# EAGLE design BatteryBalancer (EAGLE 9.2.2)

## Sheet 1 of 4: Connectors
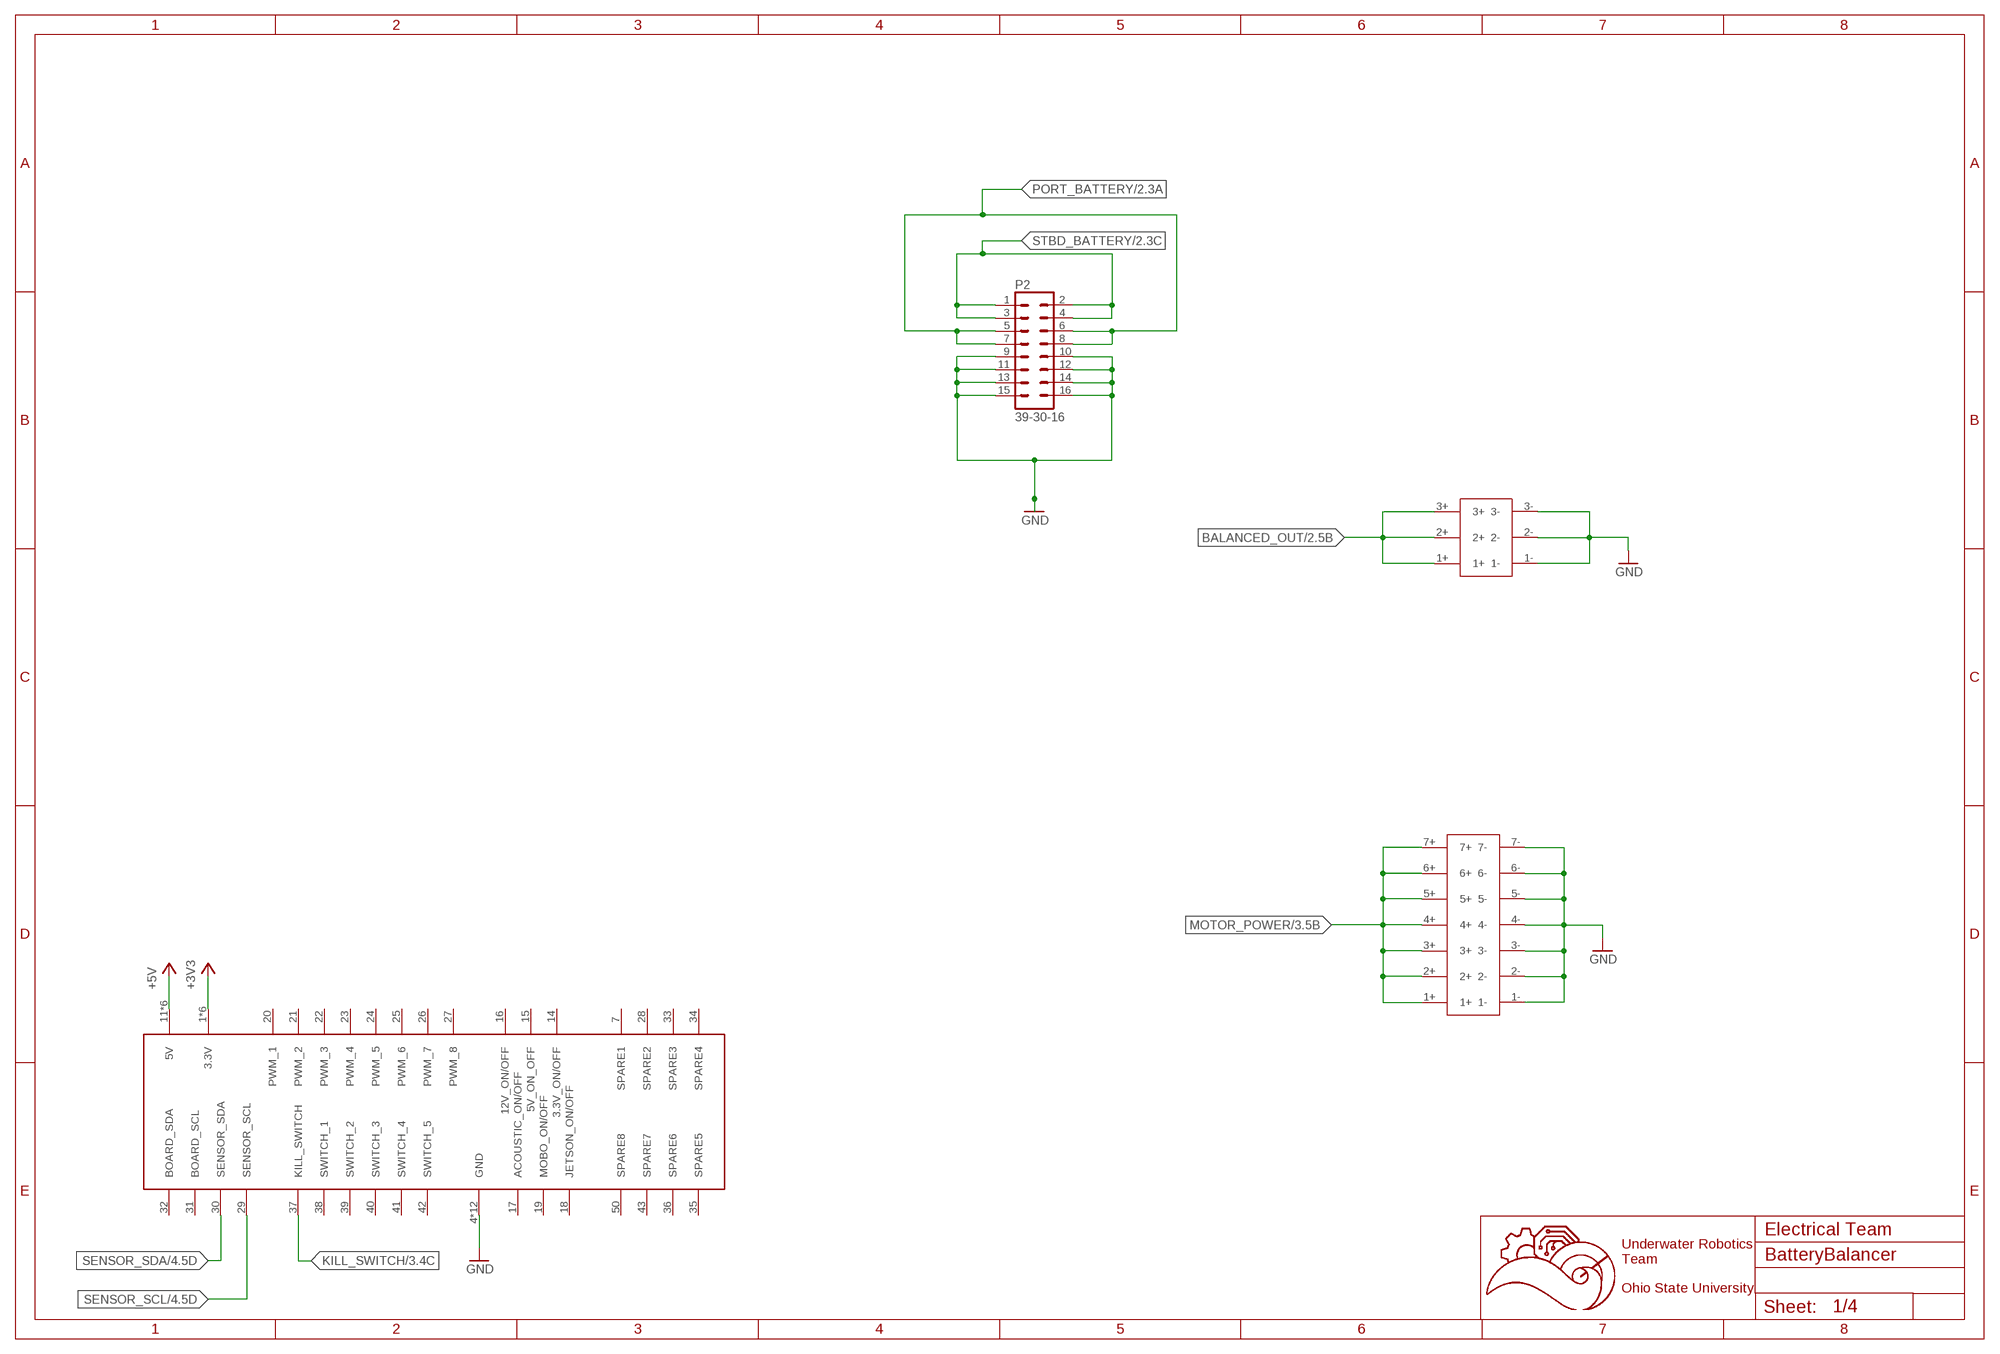
[diagram p0: schematic, sheet 1]

### Parts
P2  39-30-16  [39-30-?16?]
U$1  5530843-EDGE  [5530843-6-BOARDFINGERS]
U$4  14PIN-VERT  [14PIN_VERT]
U$13  6PIN-VERT  [6PIN_VERT]

### Nets
+3V3: U$1.1(3.3V) U$1.2(3.3V) U$1.3(3.3V) U$1.54(3.3V) U$1.55(3.3V) U$1.56(3.3V) ; also sheet 2,3,4
+5V: U$1.11(5V) U$1.12(5V) U$1.13(5V) U$1.44(5V) U$1.45(5V) U$1.46(5V)
BALANCED_OUT: U$13.1+ U$13.2+ U$13.3+ ; also sheet 2,3,4
GND: P2.9 P2.10 P2.11 P2.12 P2.13 P2.14 P2.15 P2.16 U$1.4(GND) U$1.5(GND) U$1.6(GND) U$1.8(GND) U$1.9(GND) U$1.10(GND) U$1.47(GND) U$1.48(GND) U$1.49(GND) U$1.51(GND) U$1.52(GND) U$1.53(GND) U$4.1- U$4.2- U$4.3- U$4.4- U$4.5- U$4.6- U$4.7- U$13.1- U$13.2- U$13.3- ; also sheet 2,4
KILL_SWITCH: U$1.37(KILL_SWITCH) ; also sheet 3
MOTOR_POWER: U$4.1+ U$4.2+ U$4.3+ U$4.4+ U$4.5+ U$4.6+ U$4.7+ ; also sheet 3
PORT_BATTERY: P2.5 P2.6 P2.7 P2.8 ; also sheet 2,4
SENSOR_SCL: U$1.29(SENSOR_SCL) ; also sheet 4
SENSOR_SDA: U$1.30(SENSOR_SDA) ; also sheet 4
STBD_BATTERY: P2.1 P2.2 P2.3 P2.4 ; also sheet 2,4
Unconnected: U$1.7(SPARE1) U$1.14(3.3V_ON/OFF) U$1.15(5V_ON_OFF) U$1.16(12V_ON/OFF) U$1.17(ACOUSTIC_ON/OFF) U$1.18(JETSON_ON/OFF) U$1.19(MOBO_ON/OFF) U$1.20(PWM_1) U$1.21(PWM_2) U$1.22(PWM_3) U$1.23(PWM_4) U$1.24(PWM_5) U$1.25(PWM_6) U$1.26(PWM_7) U$1.27(PWM_8) U$1.28(SPARE2) U$1.31(BOARD_SCL) U$1.32(BOARD_SDA) U$1.33(SPARE3) U$1.34(SPARE4) U$1.35(SPARE5) U$1.36(SPARE6) U$1.38(SWITCH_1) U$1.39(SWITCH_2) U$1.40(SWITCH_3) U$1.41(SWITCH_4) U$1.42(SWITCH_5) U$1.43(SPARE7) U$1.50(SPARE8)

### Notes on the sheet
- Electrical Team
- Underwater Robotics
  Team
  
  Ohio State University

## Sheet 2 of 4: Balancing
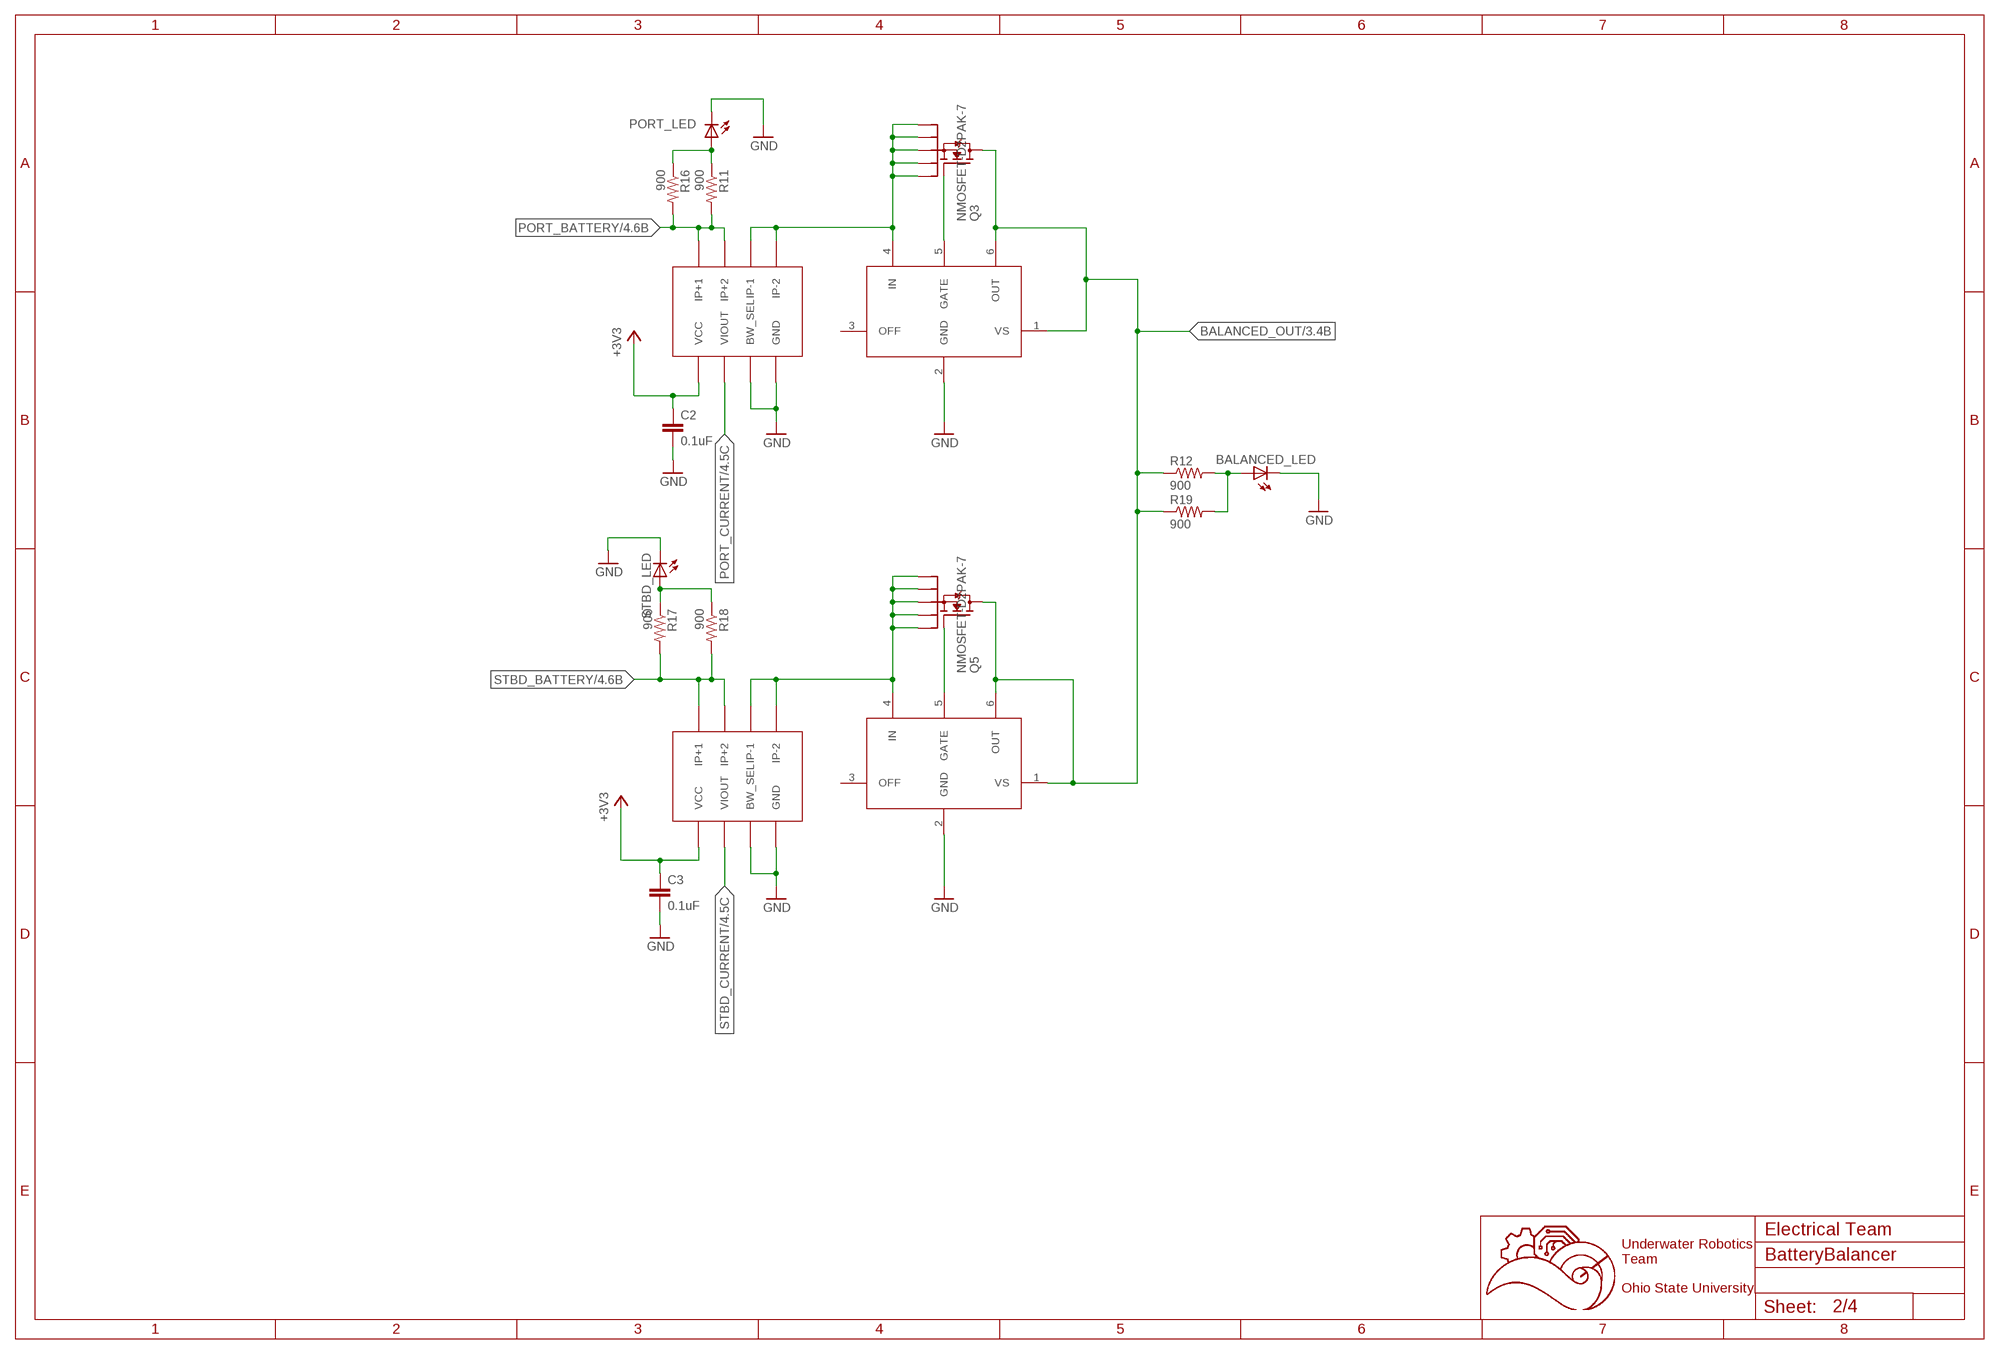
[diagram p1: schematic, sheet 2]

### Parts
BALANCED_LED  LEDCHIP-LED0603  [CHIP-LED0603]
C2  0.1uF  C-EUC0603  [C0603]
C3  0.1uF  C-EUC0603  [C0603]
PORT_LED  LEDCHIP-LED0603  [CHIP-LED0603]
Q3  NMOSFET-D2PAK-7  [D2PAK-7]
Q5  NMOSFET-D2PAK-7  [D2PAK-7]
R11  900  R-US_R0603  [R0603]
R12  900  R-US_R0603  [R0603]
R16  900  R-US_R0603  [R0603]
R17  900  R-US_R0603  [R0603]
R18  900  R-US_R0603  [R0603]
R19  900  R-US_R0603  [R0603]
STBD_LED  LEDCHIP-LED0603  [CHIP-LED0603]
U$2  LM5050  [LM5050]
U$3  LM5050  [LM5050]
U$6  ACS722  [SOIC-8]
U$7  ACS722  [SOIC-8]

### Nets
+3V3: C2.1 C3.1 U$6.VCC U$7.VCC ; also sheet 1,3,4
BALANCED_OUT: Q3.D Q5.D R12.1 R19.1 U$2.1(VS) U$2.6(OUT) U$3.1(VS) U$3.6(OUT) ; also sheet 1,3,4
GND: BALANCED_LED.C C2.2 C3.2 PORT_LED.C STBD_LED.C U$2.2(GND) U$3.2(GND) U$6.BW_SEL U$6.GND U$7.BW_SEL U$7.GND ; also sheet 1,4
N$1: Q3.S1 Q3.S2 Q3.S3 Q3.S4 Q3.S5 U$2.4(IN) U$6.IP-1 U$6.IP-2
N$2: Q3.G U$2.5(GATE)
N$5: Q5.G U$3.5(GATE)
N$11: PORT_LED.A R11.1 R16.1
N$12: R17.1 R18.1 STBD_LED.A
N$13: BALANCED_LED.A R12.2 R19.2
PORT_BATTERY: R11.2 R16.2 U$6.IP+1 U$6.IP+2 ; also sheet 1,4
PORT_CURRENT: U$6.VIOUT ; also sheet 4
SOURCE: Q5.S1 Q5.S2 Q5.S3 Q5.S4 Q5.S5 U$3.4(IN) U$7.IP-1 U$7.IP-2
STBD_BATTERY: R17.2 R18.2 U$7.IP+1 U$7.IP+2 ; also sheet 1,4
STBD_CURRENT: U$7.VIOUT ; also sheet 4
Unconnected: U$2.3(OFF) U$3.3(OFF)

### Notes on the sheet
- Electrical Team
- Underwater Robotics
  Team
  
  Ohio State University

## Sheet 3 of 4: Relays
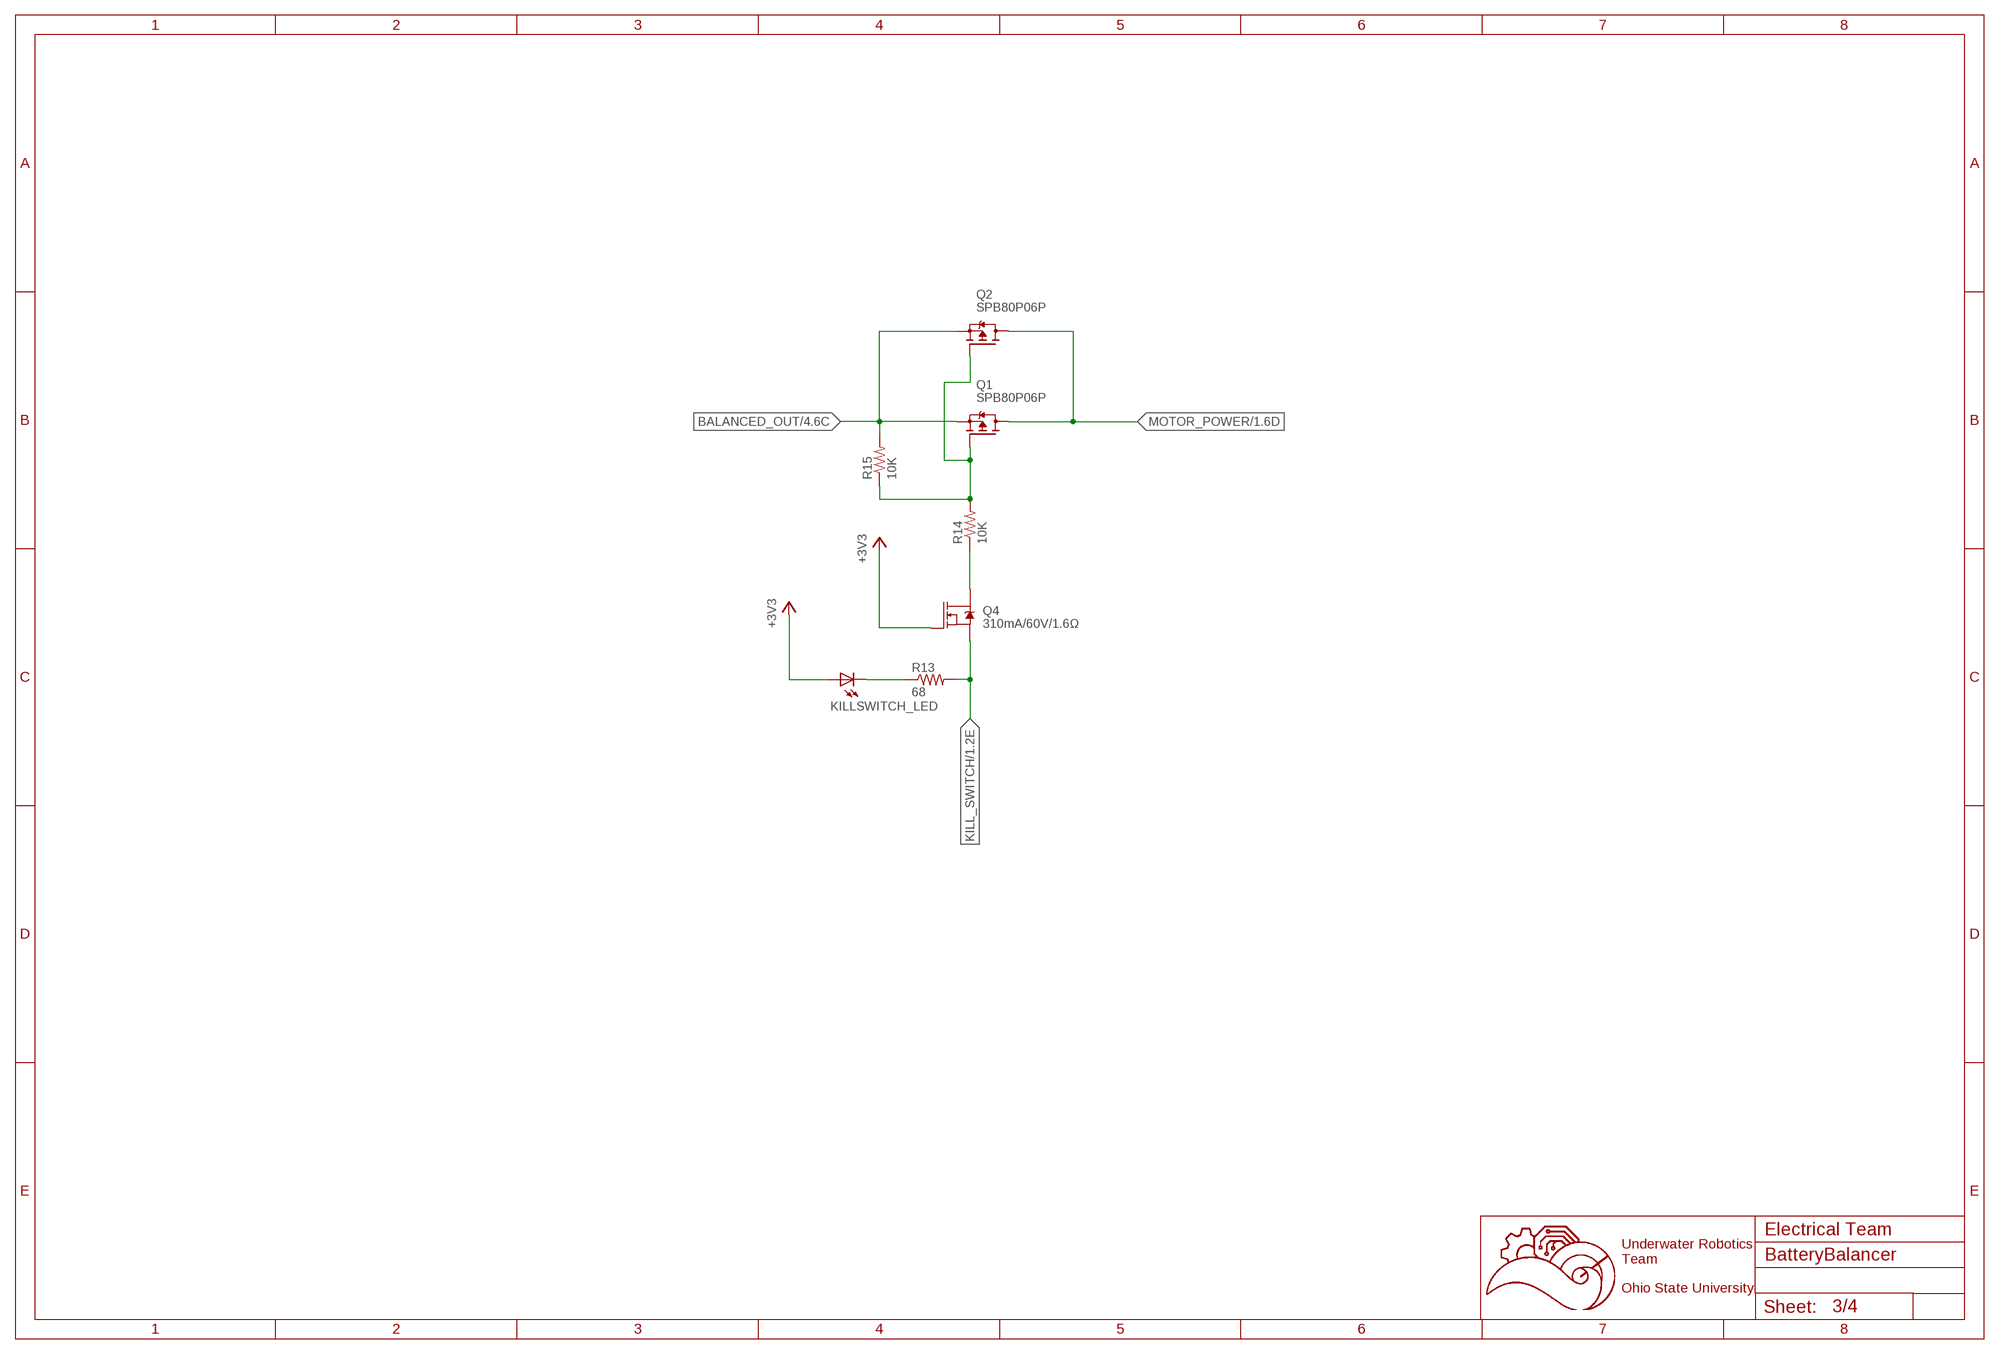
[diagram p2: schematic, sheet 3]

### Parts
KILLSWITCH_LED  LEDCHIP-LED0603  [CHIP-LED0603]
Q1  SPB80P06P  [TO263]
Q2  SPB80P06P  [TO263]
Q4  310mA/60V/1.6Ω  MOSFET-NCH-2N7002PW  [SOT323]
R13  68  R-US_R0603  [R0603]
R14  10K  R-US_R0603  [R0603]
R15  10K  R-US_R0603  [R0603]

### Nets
+3V3: KILLSWITCH_LED.A Q4.1(G) ; also sheet 1,2,4
BALANCED_OUT: Q1.2(S) Q2.2(S) R15.2 ; also sheet 1,2,4
KILL_SWITCH: Q4.2(S) R13.2 ; also sheet 1
MOTOR_POWER: Q1.3(D) Q2.3(D) ; also sheet 1
N$4: Q4.3(D) R14.1
N$8: Q1.1(G) Q2.1(G) R14.2 R15.1
N$16: KILLSWITCH_LED.C R13.1

### Notes on the sheet
- Electrical Team
- Underwater Robotics
  Team
  
  Ohio State University

## Sheet 4 of 4: ADC
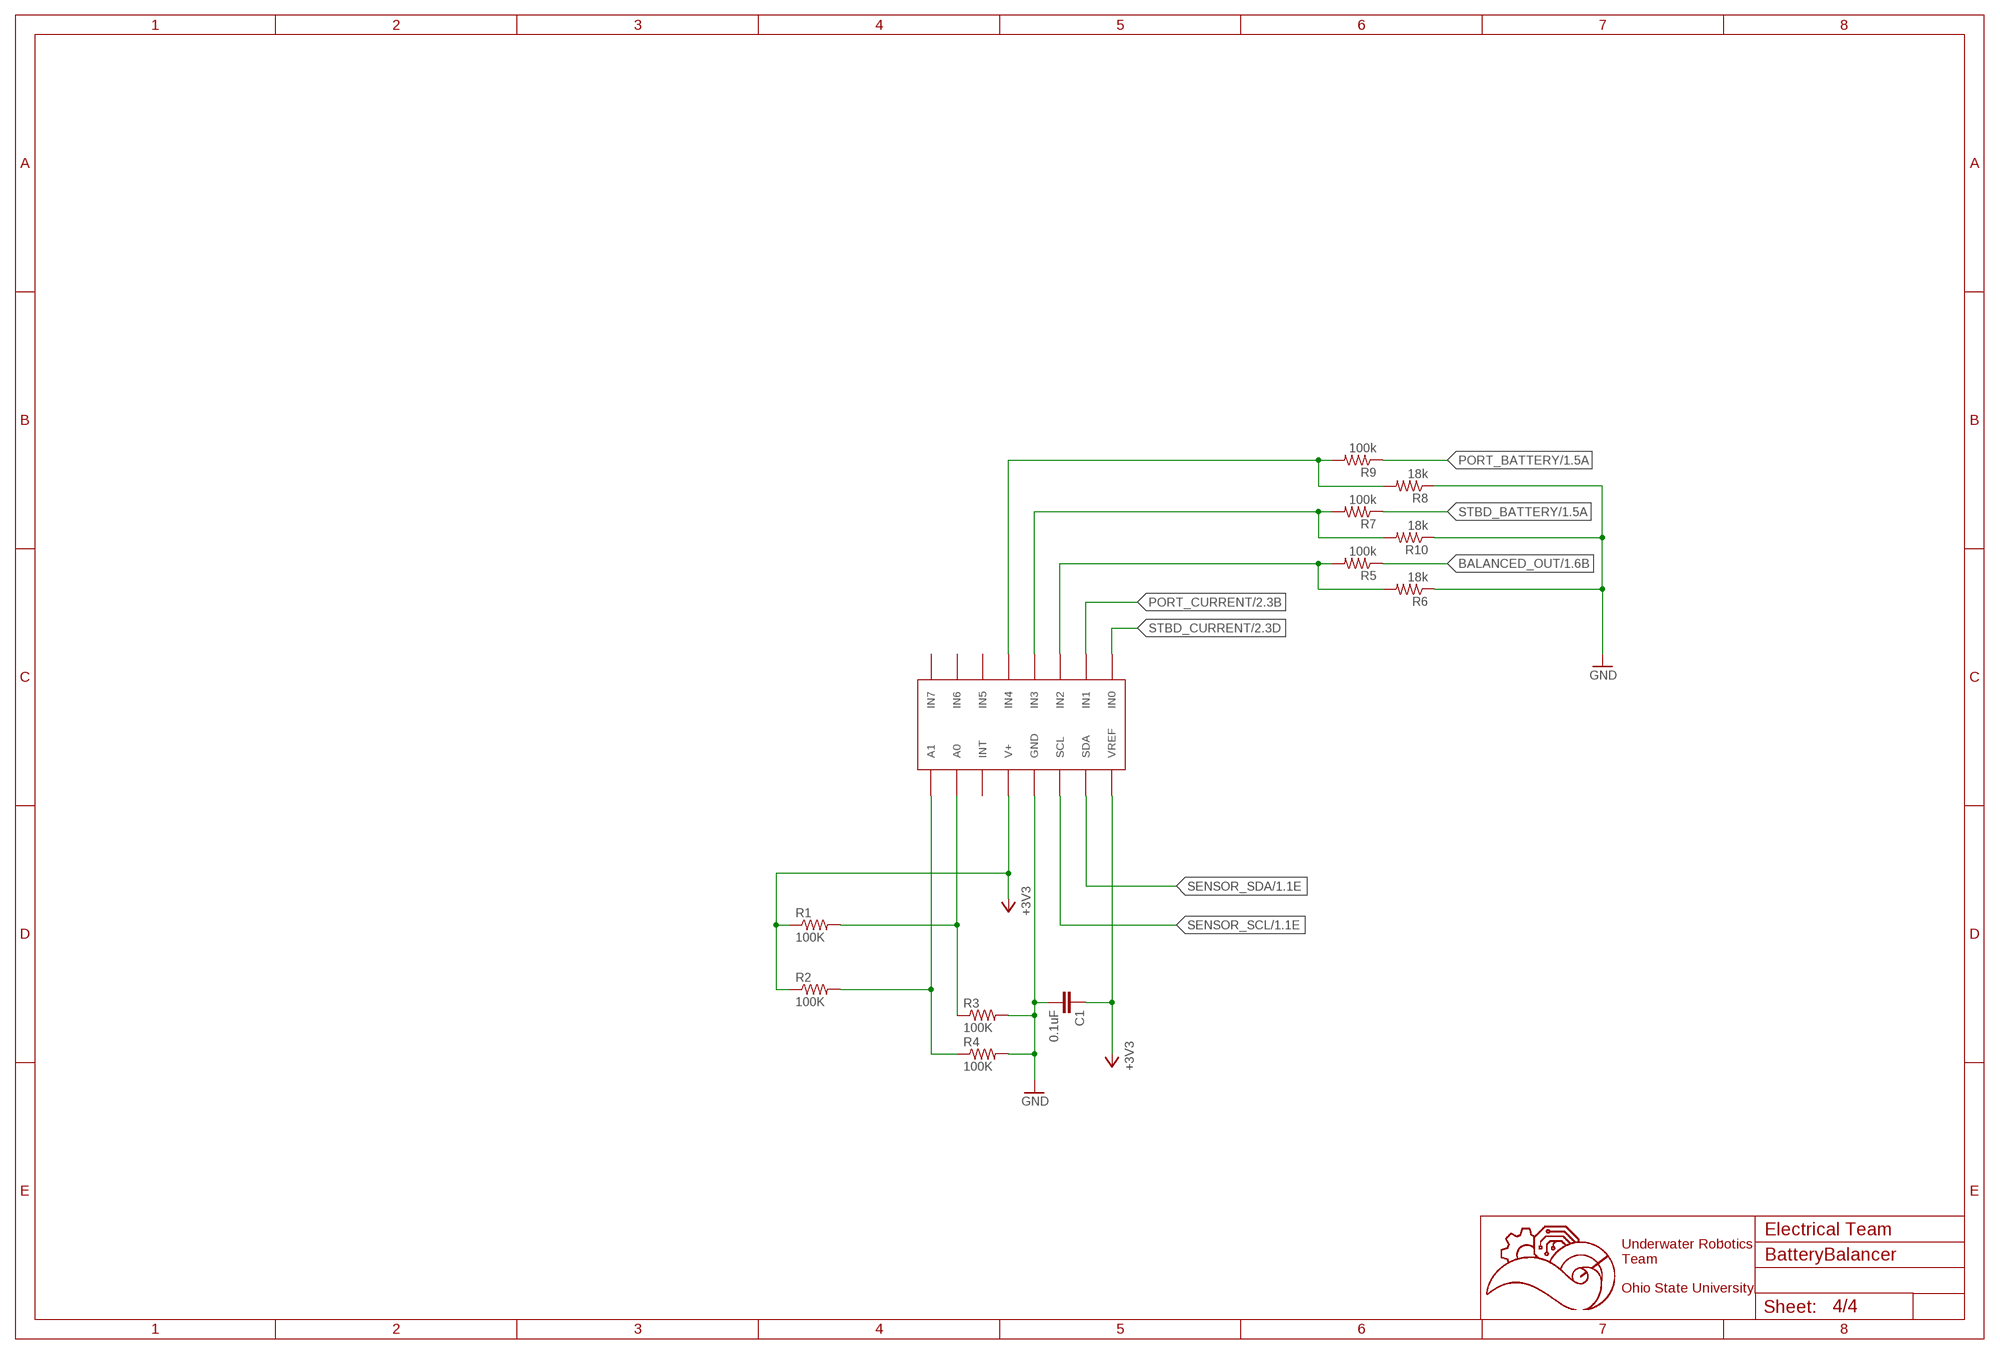
[diagram p3: schematic, sheet 4]

### Parts
C1  0.1uF  C-EUC0603  [C0603]
R1  100K  R-US_R0603  [R0603]
R2  100K  R-US_R0603  [R0603]
R3  100K  R-US_R0603  [R0603]
R4  100K  R-US_R0603  [R0603]
R5  100k  R-US_R0603  [R0603]
R6  18k  R-US_R0603  [R0603]
R7  100k  R-US_R0603  [R0603]
R8  18k  R-US_R0603  [R0603]
R9  100k  R-US_R0603  [R0603]
R10  18k  R-US_R0603  [R0603]
U$12  ADC128D818  [TSSOP-16]

### Nets
+3V3: C1.1 R1.1 R2.1 U$12.V+ U$12.VREF ; also sheet 1,2,3
BALANCED_OUT: R5.1 ; also sheet 1,2,3
GND: C1.2 R3.2 R4.2 R6.1 R8.1 R10.1 U$12.GND ; also sheet 1,2
N$6: R2.2 R4.1 U$12.A1
N$7: R1.2 R3.1 U$12.A0
N$9: R7.2 R10.2 U$12.IN3
N$10: R8.2 R9.2 U$12.IN4
N$15: R5.2 R6.2 U$12.IN2
PORT_BATTERY: R9.1 ; also sheet 1,2
PORT_CURRENT: U$12.IN1 ; also sheet 2
SENSOR_SCL: U$12.SCL ; also sheet 1
SENSOR_SDA: U$12.SDA ; also sheet 1
STBD_BATTERY: R7.1 ; also sheet 1,2
STBD_CURRENT: U$12.IN0 ; also sheet 2
Unconnected: U$12.IN5 U$12.IN6 U$12.IN7 U$12.INT

### Notes on the sheet
- Electrical Team
- Underwater Robotics
  Team
  
  Ohio State University

## Library data of the parts
BALANCED_LED KILLSWITCH_LED PORT_LED STBD_LED = led:LED: LED OSRAM: - CHIPLED LG R971, LG N971, LY N971, LG Q971, LY Q971, LO R971, LY R971 LH N974, LH R974 LS Q976, LO Q976, LY Q976 LO Q996 - Hyper CHIPLED LW Q18S LB Q993, LB Q99A, LB R99A - SideLED LS A670, LO A670, LY A670, LG A670, LP A670 LB A673, LV A673, LT A673, LW A673 LH A674 LY A675 LS A676, LA A676, LO A676, LY A676, LW A676 LS A679, LY A679, LG A679 - Hyper Micro SIDELED® LS Y876, LA Y876, LO Y876, LY Y876 LT Y87S - SmartLED LW L88C, LW L88S LB L89C, LB L89S, LG L890 LS L89K, LO L89K, LY L89K LS L896, LA L896, LO L896, LY L896 - TOPLED LS T670, LO T670, LY T670, LG T670, LP T670 LSG T670, LSP T670, LSY T670, LOP T670, LYG T670 LG T671, LOG T671, LSG T671 LB T673, LV T673, LT T673, LW T673 LH T674 LS T676, LA T676, LO T676, LY T676, LB T676, LH T676, LSB T676, LW T676 LB T67C, LV T67C, LT T67C, LS T67K, LO T67K, LY T67K, LW E67C LS E67B, LA E67B, LO E67B, LY E67B, LB E67C, LV E67C, LT E67C LW T67C LS T679, LY T679, LG T679 LS T770, LO T770, LY T770, LG T770, LP T770 LB T773, LV T773, LT T773, LW T773 LH T774 LS E675, LA E675, LY E675, LS T675 LS T776, LA T776, LO T776, LY T776, LB T776 LHGB T686 LT T68C, LB T68C - Hyper Mini TOPLED® LB M676 - Mini TOPLED Santana® LG M470 LS M47K, LO M47K, LY M47K Source: http://www.osram.convergy.de LUXEON: - LUMILED® LXK2-PW12-R00, LXK2-PW12-S00, LXK2-PW14-U00, LXK2-PW14-V00 LXK2-PM12-R00, LXK2-PM12-S00, LXK2-PM14-U00 LXK2-PE12-Q00, LXK2-PE12-R00, LXK2-PE12-S00, LXK2-PE14-T00, LXK2-PE14-U00 LXK2-PB12-K00, LXK2-PB12-L00, LXK2-PB12-M00, LXK2-PB14-N00, LXK2-PB14-P00, LXK2-PB14-Q00 LXK2-PR12-L00, LXK2-PR12-M00, LXK2-PR14-Q00, LXK2-PR14-R00 LXK2-PD12-Q00, LXK2-PD12-R00, LXK2-PD12-S00 LXK2-PH12-R00, LXK2-PH12-S00 LXK2-PL12-P00, LXK2-PL12-Q00, LXK2-PL12-R00 Source: www.luxeon.com KINGBRIGHT: KA-3528ASYC Source: www.kingbright.com
C1-C3 = rcl:C-EU: CAPACITOR, European symbol; SPICEPREFIX: C
P2 = con-molex-mini-fit:39-30-?16?: HEADER
Q1 Q2 = transistor-fet:SPB80P06P: SIPMOS (R) Power-Transistor P-Channel, Enhancement mode Source: http://www.infineon.com/upload/Document/cmc_upload/documents/011/3685/SPP80P06P.pdf
Q3 Q5 = D2PAK-7:NMOSFET-D2PAK-7
Q4 = SparkFun-DiscreteSemi:MOSFET-NCH: N-channel MOSFETs Voltage controlled devices that allow control of high current outputs. SparkFun Products: SparkFun OpenScale <https://www.sparkfun.com/products/13261> SparkFun Digital Sandbox <https://www.sparkfun.com/products/12651> SparkFun Monster Moto Shield <https://www.sparkfun.com/products/10182> SparkFun MOSFET Power Controller <https://www.sparkfun.com/products/11214>; PROD_ID: TRANS-11151
R1-R19 = rcl:R-US_: RESISTOR, American symbol; SPICEPREFIX: R
U$1 = 5530843-6:5530843-EDGE
U$2 U$3 = LM5050:LM5050
U$4 = Vertical_Connectors:14PIN-VERT
U$6 U$7 = ACS722:ACS722
U$12 = ADC128D818:ADC128D818
U$13 = Vertical_Connectors:6PIN-VERT

## Board
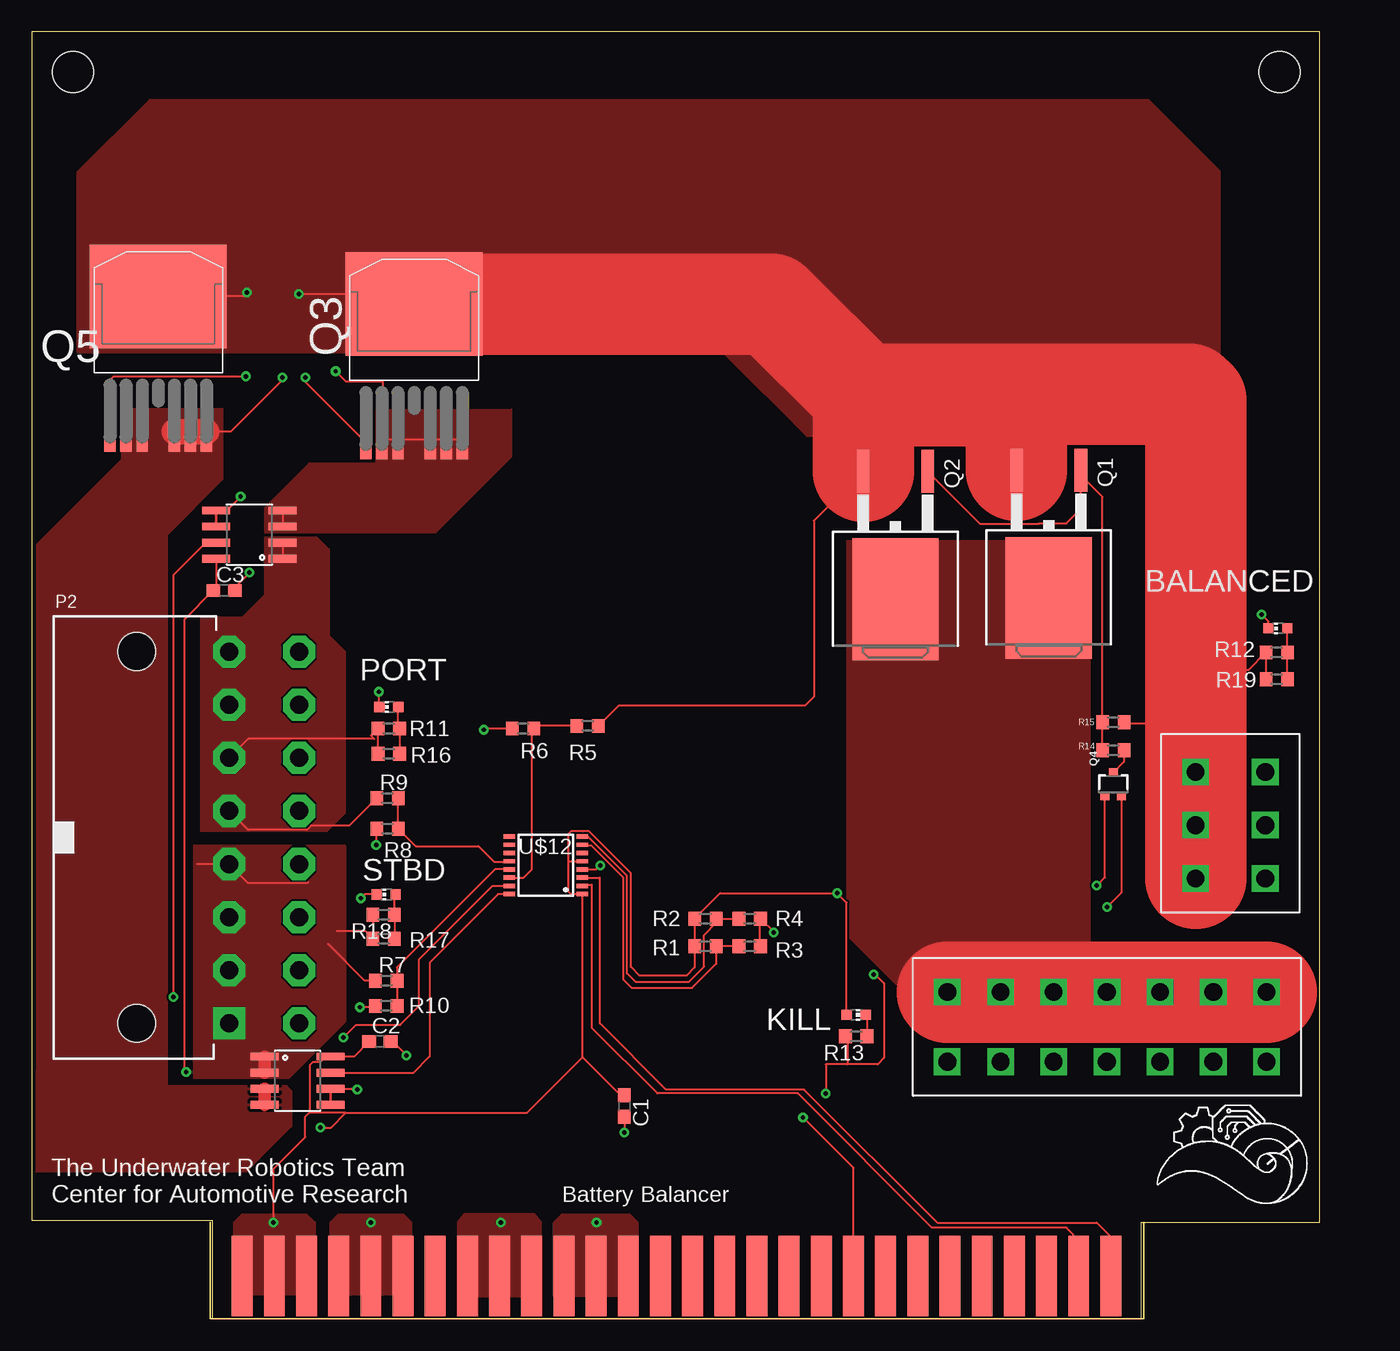
[diagram p4: board, top side]
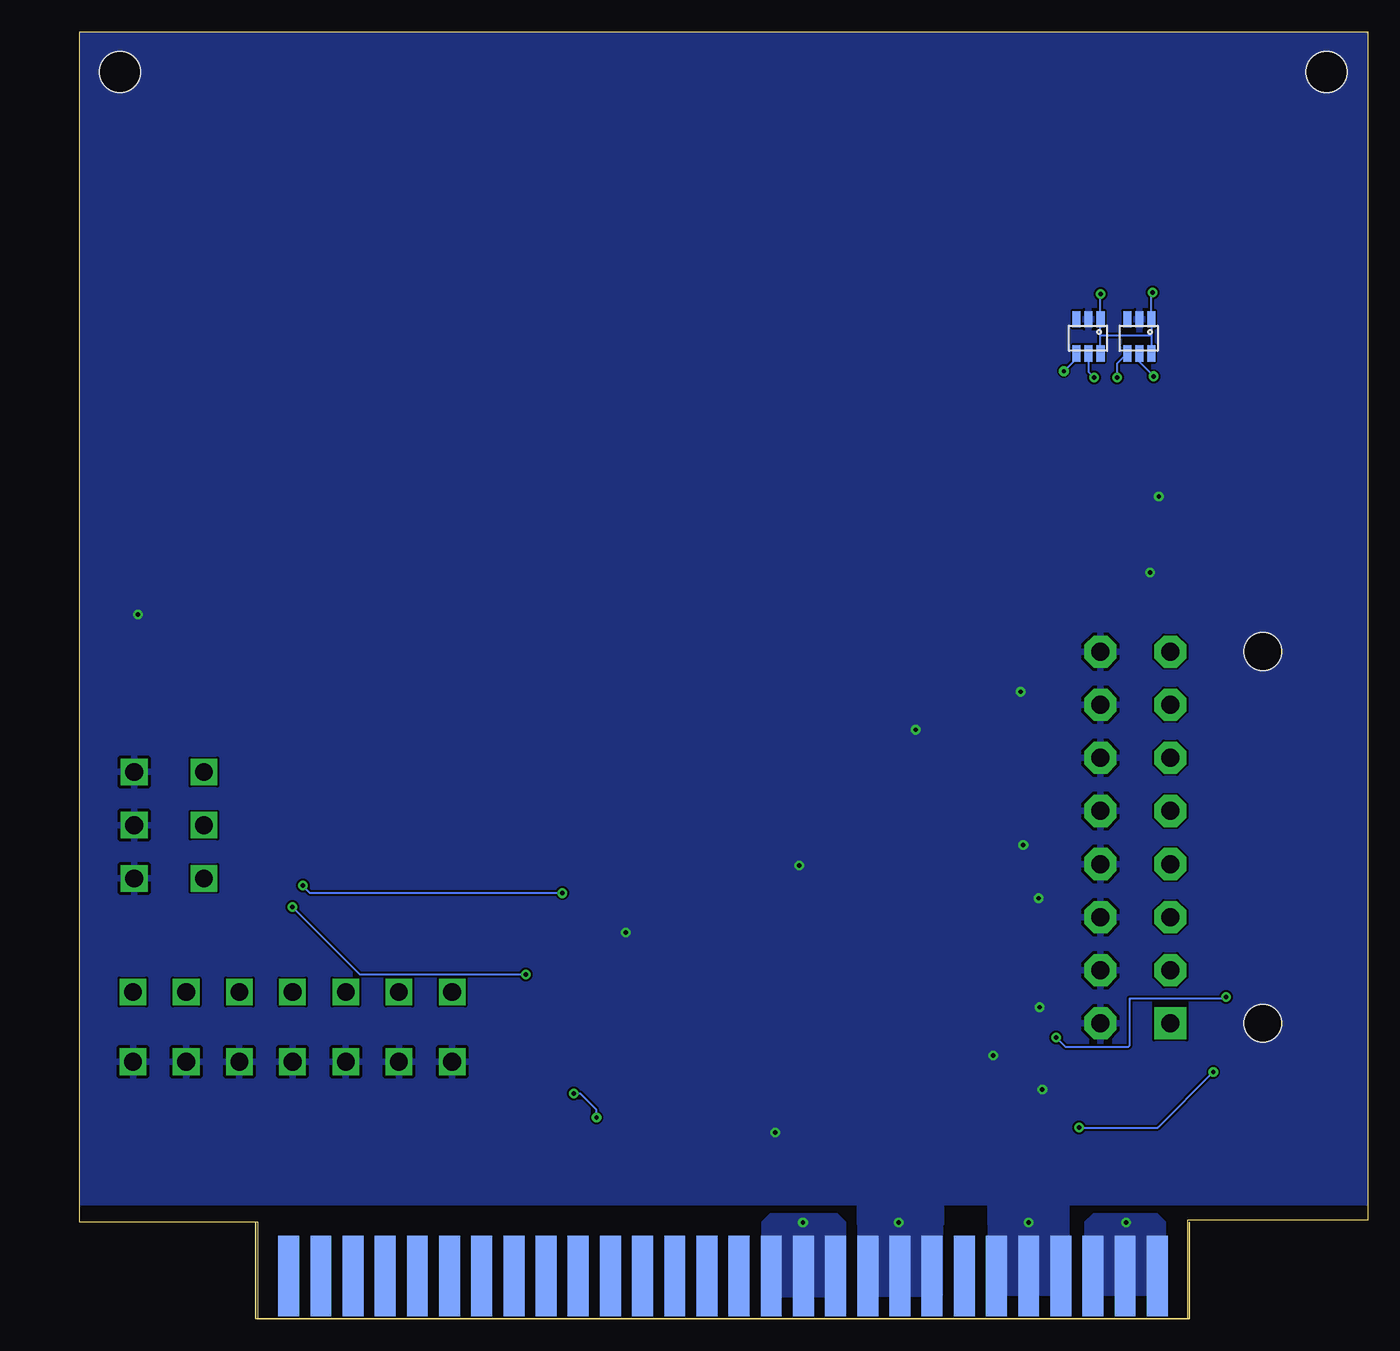
[diagram p5: board, bottom side, seen from below]

Size 101.7 x 101.6 mm. Coordinates in mm from the lower left corner, seen from the top.
Outline: 0,7.8 14.24,7.8 14.24,0 87.63,0 87.63,7.62 101.7,7.62 101.7,101.6 0,101.6 0,7.8
Copper layers (1*16): Top 0.035mm / dielectric 1.5mm / Bottom 0.035mm
Design rules "default *": minimum track width 6mil, minimum drill 0.35mm, track to track 6mil, track to pad 6mil, pad to pad 6mil, via to via 6mil, smd to smd 6mil, copper to edge 0.00508125mm, drill to drill 6mil, minimum pad ring 10mil, minimum via ring 8mil, stop-mask expansion 4mil, vias tented up to drill 0mil, thermal gap 10mil
Holes 3.26 mm at 3.27,98.42 98.52,98.42

### Footprints (pad centres in the part's own frame; a part is rotated, then mirrored left to right if it is on the bottom)
CHIP-LED0603 = smd 0.8 x 0.8: A 0,-0.75; C 0,0.75
C0603 = smd 1.1 x 1: 1 -0.85,0; 2 0.85,0
39-30-?16? = drill 1.422 pad 2.54 square: 1 14.668,0 | drill 1.422 pad 2.54 octagon: 2 10.477,0; 3 6.287,0; 4 2.095,0; 5 -2.095,0; 6 -6.287,0; 7 -10.477,0; 8 -14.668,0; 9 14.668,5.512; 10 10.477,5.512; 11 6.287,5.512; 12 2.095,5.512; 13 -2.095,5.512; 14 -6.287,5.512; 15 -10.477,5.512; 16 -14.668,5.512 | hole 3: -14.668,-7.3; 14.668,-7.3
TO263 = smd 1 x 3.4: 1 -2.54,-6.6; 2 2.54,-6.6 | smd 6.8 x 9.6: 3 0,3.5
D2PAK-7 = smd 10.8 x 8.15: D 0,4.1 | smd 0.9 x 3.2: G -3.81,-6.56; S1 -2.54,-6.56; S2 -1.27,-6.56; S3 1.27,-6.56; S4 2.54,-6.56; S5 3.81,-6.56
SOT323 = smd 0.7 x 0.7: 1 -0.65,-0.925; 2 0.65,-0.925; 3 0,0.925
R0603 = smd 1 x 1.1: 1 -0.85,0; 2 0.85,0
5530843-6-BOARDFINGERS = smd 1.651 x 6.35 bottom: 1 0.826,3.375; 2 3.365,3.375; 3 5.905,3.375; 4 8.445,3.375; 5 10.986,3.375; 6 13.525,3.375; 7 16.066,3.375; 8 18.605,3.375; 9 21.145,3.375; 10 23.686,3.375; 11 26.226,3.375; 12 28.765,3.375; 13 31.305,3.375; 14 33.846,3.375; 15 36.386,3.375; 16 38.925,3.375; 17 41.465,3.375; 18 44.005,3.375; 19 46.545,3.375; 20 49.086,3.375; 21 51.626,3.375; 22 54.166,3.375; 23 56.706,3.375; 24 59.245,3.375; 25 61.785,3.375; 26 64.326,3.375; 27 66.865,3.375; 28 69.406,3.375 | smd 1.651 x 6.35: 29 69.406,3.375; 30 66.865,3.375; 31 64.326,3.375; 32 61.785,3.375; 33 59.245,3.375; 34 56.706,3.375; 35 54.166,3.375; 36 51.626,3.375; 37 49.086,3.375; 38 46.545,3.375; 39 44.005,3.375; 40 41.465,3.375; 41 38.925,3.375; 42 36.386,3.375; 43 33.846,3.375; 44 31.305,3.375; 45 28.765,3.375; 46 26.226,3.375; 47 23.686,3.375; 48 21.145,3.375; 49 18.605,3.375; 50 16.066,3.375; 51 13.525,3.375; 52 10.986,3.375; 53 8.445,3.375; 54 5.905,3.375; 55 3.365,3.375; 56 0.826,3.375
LM5050 = smd 0.635 x 1.27: 1 0,0; 2 0.95,0; 3 1.9,0; 4 1.9,2.7; 5 0.95,2.7; 6 0,2.7
14PIN_VERT = drill 1.4 square: 1+ 0,0; 1- 5.5,0; 2+ 0,4.2; 2- 5.5,4.2; 3+ 0,8.4; 3- 5.5,8.4; 4+ 0,12.6; 4- 5.5,12.6; 5+ 0,16.8; 5- 5.5,16.8; 6+ 0,21; 6- 5.5,21; 7+ 0,25.2; 7- 5.5,25.2
SOIC-8 = smd 0.61 x 2.21: BW_SEL 0.635,2.616; GND 1.905,2.616; IP+1 -1.905,-2.616; IP+2 -0.635,-2.616; IP-1 0.635,-2.616; IP-2 1.905,-2.616; VCC -1.905,2.616; VIOUT -0.635,2.616
TSSOP-16 = smd 0.9 x 0.35: A0 -2.875,-1.625; A1 -2.875,-2.275; GND -2.875,0.325; IN0 2.875,2.275; IN1 2.875,1.625; IN2 2.875,0.975; IN3 2.875,0.325; IN4 2.875,-0.325; IN5 2.875,-0.975; IN6 2.875,-1.625; IN7 2.875,-2.275; INT -2.875,-0.975; SCL -2.875,0.975; SDA -2.875,1.625; V+ -2.875,-0.325; VREF -2.875,2.275
6PIN_VERT = drill 1.4 square: 1+ 0,0; 1- 5.5,0; 2+ 0,4.2; 2- 5.5,4.2; 3+ 0,8.4; 3- 5.5,8.4

### Placement (x,y rotation side)
BALANCED_LED  98.4,54.5 90 top
C1  46.8,16.8 270 top
C2  27.5,21.9 0 top
C3  15.2,57.5 0 top
KILLSWITCH_LED  65.1,24 270 top
P2  39-30-16?  [39-30-?16?]  15.6,38 270 top
PORT_LED  28.2,48.3 90 top
Q1  80.3,60.4 180 top
Q2  68.2,60.3 180 top
Q3  30.2,76 0 top
Q4  85.4,42.2 0 top
Q5  10,76.6 0 top
R1  53.2,29.4 0 top
R2  53.2,31.6 0 top
R3  56.7,29.4 0 top
R4  56.7,31.6 0 top
R5  43.9,46.8 180 top
R6  38.8,46.6 0 top
R7  28,26.7 0 top
R8  28.1,38.7 0 top
R9  28.1,41.1 0 top
R10  28,24.7 0 top
R11  2k  [R0603]  28.2,46.6 180 top
R12  2k  [R0603]  98.3,52.6 0 top
R13  65.1,22.3 180 top
R14  85.4,44.9 180 top
R15  85.4,47.1 0 top
R16  2k  [R0603]  28.2,44.6 180 top
R17  2k  [R0603]  27.8,30 180 top
R18  2k  [R0603]  27.8,31.9 180 top
R19  2k  [R0603]  98.3,50.5 0 top
STBD_LED  28,33.5 90 top
U$1  15.8,0 0 top
U$2  21.1,78.9 180 bottom
U$3  17.1,78.9 180 bottom
U$4  72.3,25.8 270 top
U$6  17.2,61.9 90 top
U$7  21,18.8 270 top
U$12  40.6,35.8 180 top
U$13  91.9,34.77 0 top

### Tracks (layer width: path | path; a pad name or v marks a point on that pad's centre or on a via)
+3V3  (via drill 0.35)
  Top 0.152: 24.8,16.26 39.1,16.26 43.5,20.66 | 24.8,16.26 21.92,16.26 | 21.92,16.26 21.98,16.32 21.98,20.06 22.19,20.27 22.77,20.27 23.2,20.7 U$7.VCC 25.46,20.7 C2.1 | 21.92,16.26 21.61,15.96 21.61,14.35 19.1,11.83 v19.1,7.6 | U$6.VCC 14.58,57.73 C3.1 12.05,55.2 12.05,19.65 v12.2,19.5 | v22.8,15.1 23.64,15.1 24.8,16.26 | v84.1,34.2 84.75,34.85 Q4.1 | 42.4,36.1 42.4,33.7 42.58,33.52 U$12.VREF 43.5,33.5 43.5,20.66 | 42.4,36.1 42.4,38.3 42.6,38.5 43.5,38.5 43.52,38.48 44.02,38.48 47.31,35.19 47.31,27.79 48,27.1 51.7,27.1 52.35,27.75 R1.1 R2.1 54.35,33.6 v63.6,33.6 64.35,32.85 KILLSWITCH_LED.A | 42.4,36.1 42.43,36.12 U$12.V+ | 43.5,20.66 46.51,17.65 C1.1
  Bottom 0.152: v12.2,19.5 16.6,15.1 v22.8,15.1 | v63.6,33.6 83.5,33.6 v84.1,34.2
  pour Bottom (no thermals): 15.97,7.62 16.61,8.26 21.69,8.26 22.33,7.62 22.33,1.91 15.97,1.91
  pour Top (no thermals): 15.97,7.62 16.61,8.26 21.69,8.26 22.33,7.62 22.33,1.91 15.97,1.91
+5V  (via drill 0.35)
  other vias: 44.6,7.6
  pour Top (no thermals): 41.25,1.78 41.25,7.62 41.88,8.26 47.22,8.26 47.85,7.62 47.85,1.78
  pour Bottom (no thermals): 41.25,1.78 41.25,7.62 41.88,8.26 47.22,8.26 47.85,7.62 47.85,1.78
BALANCED_OUT  (via drill 0.35)
  Top 0.152: R15.2 86.35,47 88.07,47 U$13.3+ | v21.1,80.9 29.4,80.9 Q3.D | v17,81 16.7,80.7 Q5.D | 91.9,51.2 96.05,51.2 R12.1 R19.1 | Q2.2 61.76,63 61.76,49.1 61.06,48.4 46.35,48.4 R5.1
  Top 8: Q2.2 65.66,72.86 | 65.66,72.86 58.42,80.1 Q3.D | Q1.2 77.76,71.34 76.24,72.86 65.66,72.86 | 65.66,72.86 65.8,73 91.4,73 91.9,72.5 91.9,51.2 U$13.3+ U$13.2+ U$13.1+
  Bottom 0.152: 17.1,77.7 U$3.1 17.1,80.9 v17,81 | 17.1,77.7 U$3.6 | U$2.6 21.1,77.6 | 21.1,77.6 U$2.1 v21.1,80.9 | 17.1,77.7 17.2,77.6 21.1,77.6
  pour Top (no thermals): 3.6,76.3 54.6,76.3 61.2,69.7 88.3,69.7 93.8,75.2 93.8,90.6 88.2,96.2 9.3,96.2 3.6,90.5
GND  (via drill 0.35)
  Top 0.152: U$7.BW_SEL 25.64,18.16 v25.7,18.1 | R3.2 57.52,29.43 57.52,31.6 R4.2 58.6,30.55 v58.6,30.5 | C1.2 v46.8,14.7 | U$12.GND 44.58,35.48 v44.9,35.8 | R8.1 27.2,38.65 v27.2,37.4 | R10.1 27.05,24.6 v25.9,24.6 | PORT_LED.C 27.45,49.45 v27.4,49.5 | STBD_LED.C 26.3,33.5 v26,33.2 | R6.1 35.8,46.6 v35.7,46.5 | v29.6,20.8 28.5,21.9 C2.2 | C3.2 16.05,57.75 v17.2,58.9 | BALANCED_LED.C 97.65,55.05 v97.1,55.6 | U$6.GND 15.4,63.8 v16.5,64.9
  Top 0.2: U$6.GND U$6.BW_SEL | U$7.BW_SEL U$7.GND
  other vias: 26.77,7.62 37.06,7.62
  pour Top (no thermals): 23.6,7.62 24.23,8.26 29.31,8.26 29.95,7.62 29.95,1.91 23.6,1.91
  pour Bottom (no thermals): 23.6,7.62 24.23,8.26 29.31,8.26 29.95,7.62 29.95,1.91 23.6,1.91
  pour Top (no thermals): 33.76,1.78 40.23,1.78 40.23,7.62 39.72,8.26 34.14,8.26 33.63,7.62 33.63,1.91
  pour Bottom (no thermals): 33.63,7.62 33.63,1.91 33.76,1.78 40.11,1.78 40.11,4.06 40.11,5.71 40.23,5.84 40.23,7.62 39.72,8.26 34.14,8.26
  pour Bottom: 102.3,101.8 102.2,101.9 -0.3,101.9 -0.6,101.6 -0.6,9.7 -0.1,9.2 102.2,9.2 102.3,9.1
  pour Bottom: 23.8,9.6 23.8,7.5 29.8,7.5 29.8,9.4 29.6,9.6
  pour Bottom: 33.7,7.6 33.7,9.4 33.8,9.5 40,9.5 40.1,9.4 40.1,7.5 40,7.4 33.8,7.4 33.7,7.5
KILL_SWITCH  (via drill 0.35)
  Top 0.152: U$1.37 64.88,11.91 v60.9,15.9 | v62.7,17.8 62.7,20.1 64.4,20.1 | Q4.2 86.05,33.65 v84.9,32.5 | v66.5,27.2 66.6,27.2 67.3,26.5 67.3,20.6 66.8,20.1 64.4,20.1 | R13.2 64.4,22.15 64.4,20.1
  Bottom 0.152: v62.7,17.8 62.2,17.8 60.9,16.5 v60.9,15.9 | v84.9,32.5 79.6,27.2 v66.5,27.2
MOTOR_POWER
  Top 8: U$4.1+ U$4.2+ U$4.3+ U$4.4+ U$4.5+ U$4.6+ U$4.7+
  pour Top (no thermals): 69.2,25.5 64.4,30.3 64.4,61.4 83.5,61.4 83.5,25.5
N$1  (via drill 0.35)
  Top 0.152: Q3.S5 Q3.S4 Q3.S3 Q3.S2 Q3.S1 | v24,74.8 24.8,74 27.7,74 27.7,69.48 Q3.S1 | Q3.S1 | U$6.IP-2 U$6.IP-1
  Bottom 0.152: U$2.4 23,75.8 v24,74.8
  pour Top (no thermals): 18.4,62.1 31.9,62.1 37.9,68.1 37.9,71.8 37.8,71.7 27.2,71.7 27.2,67.5 21.9,67.5 18.4,64
N$2  (via drill 0.35)
  Top 0.152: Q3.G 26.25,69.3 21.6,73.95 v21.6,74.3
  Bottom 0.152: U$2.5 22.05,74.75 v21.6,74.3
N$4
  Top 0.152: R14.1 86.25,43.98 Q4.3
N$5  (via drill 0.35)
  Top 0.152: Q5.G 6.19,74.11 6.48,74.4 v16.9,74.4
  Bottom 0.152: U$3.5 18.05,75.55 v16.9,74.4
N$6
  Top 0.152: R4.1 R2.2 54.05,31.25 53.1,30.3 53.1,27.8 51.88,26.57 47.7,26.57 47.01,27.27 47.01,34.98 43.96,38.03 43.52,38.03 U$12.A1
N$7
  Top 0.152: R3.1 R1.2 54.05,28.02 52.15,26.12 47.38,26.12 46.7,26.8 46.7,34.86 44.18,37.38 43.52,37.38 U$12.A0
N$8
  Top 0.152: R14.2 R15.1 84.55,64.89 82.84,66.6 | Q2.1 74.87,62.77 79.51,62.77 79.54,62.8 81.7,62.8 82.84,63.94 82.84,66.6 | 82.84,66.6 Q1.1
N$9
  Top 0.152: R10.2 R7.2 28.85,27.75 36.58,35.48 U$12.IN3
N$10
  Top 0.152: U$12.IN4 37.68,36.08 36.52,36.08 35.27,37.33 30.33,37.33 R8.2 R9.2
N$11
  Top 0.152: PORT_LED.A 28.95,46.7 R11.1 R16.1
N$12
  Top 0.152: R17.1 R18.1 28.65,33.4 STBD_LED.A
N$13
  Top 0.152: BALANCED_LED.A R12.2 R19.2
N$15
  Top 0.152: R5.2 39.9,46.8 39.7,46.6 | 39.7,46.6 R6.2 | U$12.IN2 38.83,34.83 39.5,35.5 39.5,46.4 39.7,46.6
N$16
  Top 0.152: KILLSWITCH_LED.C 65.95,23.9 R13.1
PORT_BATTERY
  Top 0.152: U$6.IP+2 U$6.IP+1 | R9.1 25.08,38.92 22.06,38.92 21.73,38.6 17.1,38.6 P2.5 | P2.6 17.1,45.78 27.05,45.78 26.79,46.04 R11.2 R16.2
  pour Top (no thermals): 13.4,55.4 22,55.4 24.7,52.7 24.7,39.9 23.3,38.5 13.4,38.5
  pour Top (no thermals): 20.7,51 15.1,51 13.7,52.4 18.4,57.1 18.4,61.7 22.5,61.7 23.5,60.7 23.5,53.8
PORT_CURRENT  (via drill 0.35)
  Top 0.152: v11.2,25.4 11.2,26.2 11.18,26.22 11.18,58.7 13.75,61.27 U$6.VIOUT | v24.6,22.2 25.6,23.2 29.1,23.2 30.6,24.7 30.6,28.4 36.38,34.17 U$12.IN1
  Bottom 0.152: v11.2,25.4 11.3,25.3 18.8,25.3 18.8,21.6 18.9,21.5 23.9,21.5 v24.6,22.2
SENSOR_SCL
  Top 0.152: U$12.SCL 44.88,34.83 44.88,23.32 50.09,18.11 61,18.11 71.5,7.6 84.1,7.6 85.21,6.5 U$1.29
SENSOR_SDA
  Top 0.152: U$12.SDA 43.58,34.27 44.23,34.27 44.23,22.98 49.4,17.8 60.5,17.8 71.1,7.2 81.7,7.2 82.22,6.67 82.22,3.82 U$1.30
SOURCE  (via drill 0.35)
  Top 0.152: v19.8,74.3 19.8,74.13 15.71,70.04 Q5.S5
  Top 1: U$7.IP-1 U$7.IP-2
  Top 2: Q5.S5 Q5.S4 Q5.S3
  Bottom 0.152: U$3.4 19.8,75.4 v19.8,74.3
  pour Top (no thermals): 3.2,16.6 10.7,16.6 10.7,61.9 15.1,66.3 15.1,71.8 7.6,71.8 7.1,71.3 7.1,67.8 0.4,61.1 0.4,19.4
  pour Top: 9.8,18.4 20.1,18.4 20.5,18 20.5,15.2 16.9,11.6 0.4,11.6 0.4,19.6 8.6,19.6
STBD_BATTERY
  Top 0.152: 21.83,34.5 21.73,34.41 17.1,34.41 P2.4 13.09,35.9 | R7.1 26.3,26.7 23.4,29.6 | 24.1,30.6 26.35,30.6 R17.2 R18.2
  Top 1: U$7.IP+1 U$7.IP+2
  pour Top (no thermals): 12.8,19 20.3,19 24.8,23.5 24.8,37.3 24.7,37.4 12.8,37.4
STBD_CURRENT
  Top 0.152: U$12.IN0 36.83,33.52 31.43,28.12 31.43,20.73 30.1,19.4 23.65,19.4 U$7.VIOUT

### Text on the board
tPlace: BALANCED | PORT | STBD | KILL | The Underwater Robotics Team / Center for Automotive Research | Battery Balancer